# Altium schematic sheet Sheet1.SchDoc
size A; SheetNumber: 1; SheetTotal: 1
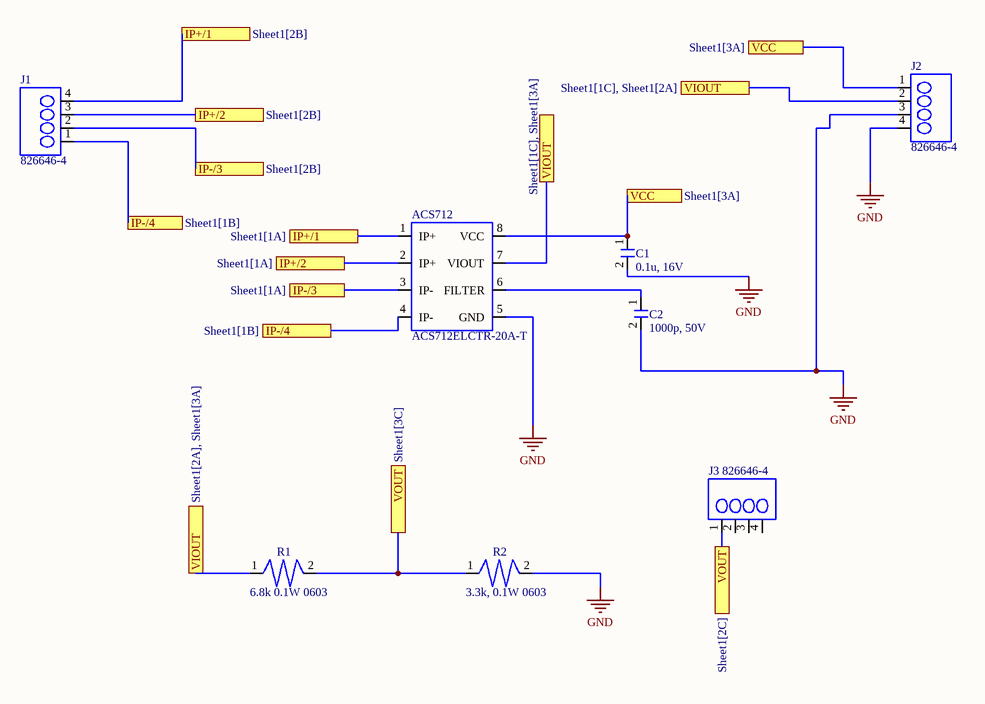
[diagram p0: Sheet1.SchDoc]

## Parts
ACS712  ACS712ELCTR-20A-T  [8SOIC]
C1  0.1u, 16V  [0603 Capacitor]
C2  1000p, 50V  [0603 Capacitor]
J1  826646-4  [Header-4Pin]
J2  826646-4  [Header-4Pin]
J3  826646-4  [Header-4Pin]
R1  6.8k 0.1W 0603  [0603 Resisitor]
R2  3.3k, 0.1W 0603  [0603 Resisitor]

## Ports
IP+/1 (see Sheet1[1A]), IP+/1 (see Sheet1[2B]), IP+/2 (see Sheet1[1A]), IP+/2 (see Sheet1[2B]), IP-/3 (see Sheet1[1A]), IP-/3 (see Sheet1[2B]), IP-/4 (see Sheet1[1B]), VCC (see Sheet1[3A]), VIOUT (see Sheet1[1C], Sheet1[2A]), VIOUT (see Sheet1[1C], Sheet1[3A]), VIOUT (see Sheet1[2A], Sheet1[3A]), VOUT (see Sheet1[2C]), VOUT (see Sheet1[3C])

## Nets
GND: ACS712.5(GND) C1.2 C2.2 J2.3 J2.4 R2.2
IP+/1: ACS712.1(IP+) J1.4 ; port IP+/1
IP+/2: ACS712.2(IP+) J1.3 ; port IP+/2
IP-/3: ACS712.3(IP-) J1.2 ; port IP-/3
IP-/4: ACS712.4(IP-) J1.1 ; port IP-/4
VCC: ACS712.8(VCC) C1.1 J2.1 ; port VCC
VIOUT: ACS712.7(VIOUT) J2.2 R1.1 ; port VIOUT
VOUT: J3.1 R1.2 R2.1 ; port VOUT
NetACS712_6: ACS712.6(FILTER) C2.1

Not connected (* = marked no-connect by the designer): J3 2 3 4

## Library data of the parts
ACS712 = ACS712ELCTR-20A-T: Analog Circuit, 1 Func, BICMOS, PDSO8; Manufacturer: Allegro MicroSystems; Package Body Material: Plastic; Channels: 1; Max Supply Voltage: 5.5V; Min Supply Voltage: 4.5V; Nominal Supply Voltage: 5V; Time @ Peak Reflow Temperature-Max (s): 40s; Qualification Status: Not Qualified; Supplier: Arrow Electronics; Supplier Part Number: ACS712ELCTR-20A-T; Manufacturer Part Number: ACS712ELCTR-20A-T; RoHS: Yes; Category: Current Sensors; Stock: 4200; Pricing: 1=2.843, 10=2.397, 25=2.366, 50=2.245, 100=1.909, 250=1.89, 500=1.78, 1000=1.702, 3000=1.678 (USD); Case/Package: SOP; Pins: 8; Package Shape: Rectangular; Terminal Finish: Tin; Min Operating Temperature: -40°C; Max Operating Temperature: 85°C; JESD-609 Code: e3; Throw Configuration: ANALOG CIRCUIT; JESD-30 Code: R-PDSO-G8; Moisture Sensitivity Level: 2; Package Style: SMALL OUTLINEMeter; Peak Reflow Temperature (Cel): 260°C; Surface Mount: Yes; Technology: BICMOS; Terminal Form: Gull Wing; Terminal Position: DUAL; Length: 4.9mm; Width: 3.9mm; Height - Seated (Max): 1.75mm; Terminal Pitch: 1.27mm; Temperature Grade: INDUSTRIAL; Reach SVHC Compliant: Yes; RoHS Compliant: Yes; ComponentLink1URL: https://datasheet.ciiva.com:443/pdfs/VipMasterIC/IC/ALLE/ALLE-S-A0009734349/ALLE-S-A0009734349-1.pdf?src-supplier=IHS+Markit; ComponentLink1Description: https://datasheet.ciiva.com:443/pdfs/VipMasterIC/IC/ALLE/ALLE-S-A0009734349/ALLE-S-A0009734349-1.pdf?src-supplier=IHS+Markit; ComponentLink2URL: https://datasheet.ciiva.com/15099/getdatasheetpartid-312820-15099471.pdf?src-supplier=Verical; ComponentLink2Description: https://datasheet.ciiva.com/15099/getdatasheetpartid-312820-15099471.pdf?src-supplier=Verical; ComponentLink3URL: https://datasheet.ciiva.com/3271/acs712-datasheet-3271995.pdf?src-supplier=Avnet; ComponentLink3Description: https://datasheet.ciiva.com/3271/acs712-datasheet-3271995.pdf?src-supplier=Avnet; ComponentLink4URL: https://datasheet.ciiva.com/3272/acs712-datasheet-3272423.pdf?src-supplier=Avnet; ComponentLink4Description: https://datasheet.ciiva.com/3272/acs712-datasheet-3272423.pdf?src-supplier=Avnet; ComponentLink5URL: https://datasheet.ciiva.com/1165/64754-1165093.pdf?src-supplier=Element14; ComponentLink5Description: https://datasheet.ciiva.com/1165/64754-1165093.pdf?src-supplier=Element14
C1 = CC0603KRX7R7BB104: Ceramic Capacitor, Multilayer, Ceramic, 16V, 10% +Tol, 10% -Tol, X7R, 15% TC, 0.1uF, Surface Mount, 0603; Manufacturer: Yageo; Value: 100nF; Multilayer: Yes; Supplier: Future Electronics; Supplier Part Number: 2938116; Manufacturer Part Number: CC0603KRX7R7BB104; RoHS: Yes; Category: Ceramic Capacitors; Stock: 4556000; Pricing: 4000=0.0049, 16000=0.0047, 60000=0.0045, 160000=0.0044, 400000=0.0042 (USD); Mounting Technology: Surface Mount; Pins: 2; Dielectric Material: Ceramic; Package Shape: Rectangular; Case/Package: 0603; Terminal Finish: Nickel; Min Operating Temperature: -55°C; Max Operating Temperature: 125°C; JESD-609 Code: e3; Capacitor Type: Ceramic; Tolerance  (fill in as +-): 10%; Package Style: SMTMeter; Packaging: Tape and Reel; Tolerance (fill in as +-): 10%; Rated DC Voltage (URdc): 16V; Temperature Characteristics Code: X7R; Termination: Wraparound; Length: 1.6mm; Width: 0.8mm; Height: 0.8mm; Reach SVHC Compliant: Yes; RoHS Compliant: Yes; ComponentLink1URL: https://datasheet.ciiva.com:443/pdfs/VipMasterIC/IC/YAGO/YAGO-S-A0003557223/YAGO-S-A0003557223-1.pdf?src-supplier=IHS+Markit; ComponentLink1Description: https://datasheet.ciiva.com:443/pdfs/VipMasterIC/IC/YAGO/YAGO-S-A0003557223/YAGO-S-A0003557223-1.pdf?src-supplier=IHS+Markit; ComponentLink2URL: https://datasheet.ciiva.com/11786/0900766b80d84f1d-11786077.pdf?src-supplier=Rs; ComponentLink2Description: https://datasheet.ciiva.com/11786/0900766b80d84f1d-11786077.pdf?src-supplier=Rs; ComponentLink3URL: https://datasheet.ciiva.com/46430/1734573-46430156.pdf?src-supplier=Element14; ComponentLink3Description: https://datasheet.ciiva.com/46430/1734573-46430156.pdf?src-supplier=Element14; ComponentLink4URL: https://datasheet.ciiva.com/8033/1734573-8033797.pdf?src-supplier=Element14; ComponentLink4Description: https://datasheet.ciiva.com/8033/1734573-8033797.pdf?src-supplier=Element14; ComponentLink5URL: https://datasheet.ciiva.com/8033/70765-8033799.pdf?src-supplier=Element14; ComponentLink5Description: https://datasheet.ciiva.com/8033/70765-8033799.pdf?src-supplier=Element14; ComponentLink6URL: https://datasheet.ciiva.com/28450/1489800-28450552.pdf?src-supplier=Element14; ComponentLink6Description: https://datasheet.ciiva.com/28450/1489800-28450552.pdf?src-supplier=Element14; ComponentLink7URL: https://datasheet.ciiva.com/144/mlccorderingcode-144182.pdf?src-supplier=Digikey; ComponentLink7Description: https://datasheet.ciiva.com/144/mlccorderingcode-144182.pdf?src-supplier=Digikey; ComponentLink8URL: https://datasheet.ciiva.com/144/mlccorderingcode-144183.pdf?src-supplier=Digikey; ComponentLink8Description: https://datasheet.ciiva.com/144/mlccorderingcode-144183.pdf?src-supplier=Digikey; ComponentLink9URL: https://datasheet.ciiva.com/144/mlccorderingcode-144184.pdf?src-supplier=Digikey; ComponentLink9Description: https://datasheet.ciiva.com/144/mlccorderingcode-144184.pdf?src-supplier=Digikey; ComponentLink10URL: https://datasheet.ciiva.com/11464/upy-gphc-x7r-6-3v-to-50v-8-11464735.pdf?src-supplier=Avnet; ComponentLink10Description: https://datasheet.ciiva.com/11464/upy-gphc-x7r-6-3v-to-50v-8-11464735.pdf?src-supplier=Avnet; ComponentLink11URL: https://datasheet.ciiva.com/13395/upy-gphc-x7r-6-3v-to-50v-8-13395674.pdf?src-supplier=Mouser; ComponentLink11Description: https://datasheet.ciiva.com/13395/upy-gphc-x7r-6-3v-to-50v-8-13395674.pdf?src-supplier=Mouser; ComponentLink12URL: https://datasheet.ciiva.com/7978/1489800-7978141.pdf?src-supplier=Element14; ComponentLink12Description: https://datasheet.ciiva.com/7978/1489800-7978141.pdf?src-supplier=Element14; ComponentLink13URL: https://datasheet.ciiva.com/15165/getdatasheetpartid-63554-15165387.pdf?src-supplier=Verical; ComponentLink13Description: https://datasheet.ciiva.com/15165/getdatasheetpartid-63554-15165387.pdf?src-supplier=Verical
C2 = CC0603KRX7R9BB102: Ceramic Capacitor, Multilayer, Ceramic, 50V, 10% +Tol, 10% -Tol, X7R, 15% TC, 0.001uF, Surface Mount, 0603; Manufacturer: Yageo; Value: 1nF; Multilayer: Yes; Supplier: Future Electronics; Supplier Part Number: 7479959; Manufacturer Part Number: CC0603KRX7R9BB102; RoHS: Yes; Category: Ceramic Capacitors; Stock: 6780000; Pricing: 4000=0.0035, 16000=0.0034, 80000=0.0032, 160000=0.0032, 500000=0.003 (USD); Mounting Technology: Surface Mount; Pins: 2; Dielectric Material: Ceramic; Package Shape: Rectangular; Case/Package: 0603; Terminal Finish: Nickel; Min Operating Temperature: -55°C; Max Operating Temperature: 125°C; JESD-609 Code: e3; Capacitor Type: Ceramic; Tolerance  (fill in as +-): 10%; Package Style: SMTMeter; Packaging: Tape and Reel; Tolerance (fill in as +-): 10%; Rated DC Voltage (URdc): 50V; Temperature Characteristics Code: X7R; Termination: Wraparound; Length: 1.6mm; Width: 0.8mm; Height: 0.8mm; Reach SVHC Compliant: Yes; RoHS Compliant: Yes; ComponentLink1URL: https://datasheet.ciiva.com:443/pdfs/VipMasterIC/IC/YAGO/YAGO-S-A0003557223/YAGO-S-A0003557223-1.pdf?src-supplier=IHS+Markit; ComponentLink1Description: https://datasheet.ciiva.com:443/pdfs/VipMasterIC/IC/YAGO/YAGO-S-A0003557223/YAGO-S-A0003557223-1.pdf?src-supplier=IHS+Markit; ComponentLink2URL: https://datasheet.ciiva.com/144/mlccorderingcode-144415.pdf?src-supplier=Digikey; ComponentLink2Description: https://datasheet.ciiva.com/144/mlccorderingcode-144415.pdf?src-supplier=Digikey; ComponentLink3URL: https://datasheet.ciiva.com/11786/0900766b8079c870-11786075.pdf?src-supplier=Rs; ComponentLink3Description: https://datasheet.ciiva.com/11786/0900766b8079c870-11786075.pdf?src-supplier=Rs; ComponentLink4URL: https://datasheet.ciiva.com/144/mlccorderingcode-144416.pdf?src-supplier=Digikey; ComponentLink4Description: https://datasheet.ciiva.com/144/mlccorderingcode-144416.pdf?src-supplier=Digikey; ComponentLink5URL: https://datasheet.ciiva.com/144/mlccorderingcode-144417.pdf?src-supplier=Digikey; ComponentLink5Description: https://datasheet.ciiva.com/144/mlccorderingcode-144417.pdf?src-supplier=Digikey; ComponentLink6URL: https://datasheet.ciiva.com/46430/1734573-46430159.pdf?src-supplier=Element14; ComponentLink6Description: https://datasheet.ciiva.com/46430/1734573-46430159.pdf?src-supplier=Element14; ComponentLink7URL: https://datasheet.ciiva.com/15189/getdatasheetpartid-251790-15189165.pdf?src-supplier=Verical; ComponentLink7Description: https://datasheet.ciiva.com/15189/getdatasheetpartid-251790-15189165.pdf?src-supplier=Verical; ComponentLink8URL: https://datasheet.ciiva.com/29242/445532-da-01-en-kerko-chip-0603-np0-1000pf-29242198.pdf?src-supplier=Conrad; ComponentLink8Description: https://datasheet.ciiva.com/29242/445532-da-01-en-kerko-chip-0603-np0-1000pf-29242198.pdf?src-supplier=Conrad
J1-J3 = 826646-4: Board Connector, 4 Contact(s), 1 Row(s), Male, Straight, Solder Terminal, Green Insulator; Manufacturer: TE Connectivity; Option: General Purpose; Filter Feature: No; Number of Rows Loaded: 1; Number of Contacts: 4; Supplier: Arrow Electronics; Supplier Part Number: 826646-4; Manufacturer Part Number: 826646-4; RoHS: Yes; Category: Connectors; Stock: 10257; Pricing: 1=0.3449, 10=0.3085, 100=0.2734, 500=0.2482, 1500=0.2446 (USD); Mounting Technology: Board; Contact Material: Bronze; Contact Finish - Mating: GOLD (30); Contact Finish - Termination: TIN; Connector Type: BOARD CONNECTOR; JESD-609 Code: e3; Contact Gender: Male; Mixed Contacts: No; Mounting Style: STRAIGHT; Termination: Solder; Terminal Pitch: 2.54mm; Flammability Rating: UL94 V-0; DIN Conformance: No; IEC Conformance: No; MIL Conformance: No; Reach SVHC Compliant: Yes; RoHS Compliant: Yes; ComponentLink1URL: https://datasheet.ciiva.com:443/pdfs/VipMasterIC/IC/TYEL/TYEL-S-A0008869674/TYEL-S-A0008859122-1.pdf?src-supplier=IHS+Markit; ComponentLink1Description: https://datasheet.ciiva.com:443/pdfs/VipMasterIC/IC/TYEL/TYEL-S-A0008869674/TYEL-S-A0008859122-1.pdf?src-supplier=IHS+Markit; ComponentLink2URL: https://datasheet.ciiva.com/11754/0900766b80d7c469-11754249.pdf?src-supplier=Rs; ComponentLink2Description: https://datasheet.ciiva.com/11754/0900766b80d7c469-11754249.pdf?src-supplier=Rs; ComponentLink3URL: https://datasheet.ciiva.com/29369/001094742-da-01-en-stiftleiste-1-reihig-0-0826646-4-29369555.pdf?src-supplier=Conrad; ComponentLink3Description: https://datasheet.ciiva.com/29369/001094742-da-01-en-stiftleiste-1-reihig-0-0826646-4-29369555.pdf?src-supplier=Conrad; ComponentLink4URL: https://datasheet.ciiva.com/717/eng-cd-826629-aa-basefilename-717525.pdf?src-supplier=Digikey; ComponentLink4Description: https://datasheet.ciiva.com/717/eng-cd-826629-aa-basefilename-717525.pdf?src-supplier=Digikey
R1 = RC0603FR-106K8L: Fixed Resistor, Metal Glaze/thick Film, 0.1W, 6800ohm, 75V, 1% +/-Tol, 100ppm/Cel, Surface Mount, 0603; Manufacturer: Yageo; Additional Feature: LASER TRIMMABLE; Power: 100mW; Rated Temperature: 70°C; Value: 6.8kR; Temperature Coefficient: 100ppm/°C; Package Height: 0.45mm; Package Length: 1.6mm; Package Width: 0.8mm; Supplier: Newark; Supplier Part Number: 32AK1101; Manufacturer Part Number: RC0603FR-106K8L; RoHS: Yes; Category: Chip SMD Resistors; Stock: 10030; Pricing: 10=0.012, 25=0.01, 50=0.009, 100=0.007 (USD); Mounting Technology: Surface Mount; Pins: 2; Package Shape: Rectangular; Case/Package: 0603; Terminal Finish: Nickel; Min Operating Temperature: -55°C; Max Operating Temperature: 155°C; Tolerance: 1%; Termination: Wraparound; JESD-609 Code: e3; Resistor Type: FIXED RESISTOR; Construction: Chip; Packaging: Tape and Reel; Technology: METAL GLAZE/THICK FILM; Working Voltage: 75V; Reach SVHC Compliant: Yes; RoHS Compliant: Yes; ComponentLink1URL: https://datasheet.ciiva.com:443/pdfs/VipMasterIC/IC/YAGO/YAGO-S-A0008145938/YAGO-S-A0008145938-1.pdf?src-supplier=IHS+Markit; ComponentLink1Description: https://datasheet.ciiva.com:443/pdfs/VipMasterIC/IC/YAGO/YAGO-S-A0008145938/YAGO-S-A0008145938-1.pdf?src-supplier=IHS+Markit; ComponentLink2URL: https://datasheet.ciiva.com/12561/rc0603-272842-12561433.pdf?src-supplier=Mouser; ComponentLink2Description: https://datasheet.ciiva.com/12561/rc0603-272842-12561433.pdf?src-supplier=Mouser
R2 = RC0603FR-073K3L: Fixed Resistor, Metal Glaze/thick Film, 0.1W, 3300ohm, 75V, 1% +/-Tol, 100ppm/Cel, Surface Mount, 0603; Manufacturer: Yageo; Additional Feature: LASER TRIMMABLE; Power: 100mW; Rated Temperature: 70°C; Value: 3.3kR; Temperature Coefficient: 100ppm/°C; Package Height: 0.45mm; Package Length: 1.6mm; Package Width: 0.8mm; Supplier: Future Electronics; Supplier Part Number: 6497630; Manufacturer Part Number: RC0603FR-073K3L; RoHS: Yes; Category: Chip SMD Resistors; Stock: 1520000; Pricing: 5000=0.0019, 50000=0.0018, 150000=0.0018, 375000=0.0017, 1000000=0.0016 (USD); Mounting Technology: Surface Mount; Pins: 2; Package Shape: Rectangular; Case/Package: 0603; Terminal Finish: Nickel; Min Operating Temperature: -55°C; Max Operating Temperature: 155°C; Tolerance: 1%; JESD-609 Code: e3; Resistor Type: FIXED RESISTOR; Construction: Chip; Packaging: Tape and Reel; Technology: METAL GLAZE/THICK FILM; Termination: Wraparound; Working Voltage: 75V; Reach SVHC Compliant: Yes; RoHS Compliant: Yes; ComponentLink1URL: https://datasheet.ciiva.com:443/pdfs/VipMasterIC/IC/YAGO/YAGO-S-A0008145938/YAGO-S-A0008145938-1.pdf?src-supplier=IHS+Markit; ComponentLink1Description: https://datasheet.ciiva.com:443/pdfs/VipMasterIC/IC/YAGO/YAGO-S-A0008145938/YAGO-S-A0008145938-1.pdf?src-supplier=IHS+Markit; ComponentLink2URL: https://datasheet.ciiva.com/46440/1868787-46440905.pdf?src-supplier=Element14; ComponentLink2Description: https://datasheet.ciiva.com/46440/1868787-46440905.pdf?src-supplier=Element14; ComponentLink3URL: https://datasheet.ciiva.com/2453/pyu-r-int-thick-7-2453926.pdf?src-supplier=Digikey; ComponentLink3Description: https://datasheet.ciiva.com/2453/pyu-r-int-thick-7-2453926.pdf?src-supplier=Digikey; ComponentLink4URL: https://datasheet.ciiva.com/2453/pyu-r-int-thick-7-2453927.pdf?src-supplier=Digikey; ComponentLink4Description: https://datasheet.ciiva.com/2453/pyu-r-int-thick-7-2453927.pdf?src-supplier=Digikey; ComponentLink5URL: https://datasheet.ciiva.com/7746/443971-7746344.pdf?src-supplier=Element14; ComponentLink5Description: https://datasheet.ciiva.com/7746/443971-7746344.pdf?src-supplier=Element14; ComponentLink6URL: https://datasheet.ciiva.com/7746/1686128-7746345.pdf?src-supplier=Element14; ComponentLink6Description: https://datasheet.ciiva.com/7746/1686128-7746345.pdf?src-supplier=Element14; ComponentLink7URL: https://datasheet.ciiva.com/7746/443971-7746346.pdf?src-supplier=Element14; ComponentLink7Description: https://datasheet.ciiva.com/7746/443971-7746346.pdf?src-supplier=Element14